# Altium project ESP32_INDUSTRIAL_IO_BASEBOARD.PrjPcb (part 1 of 2)
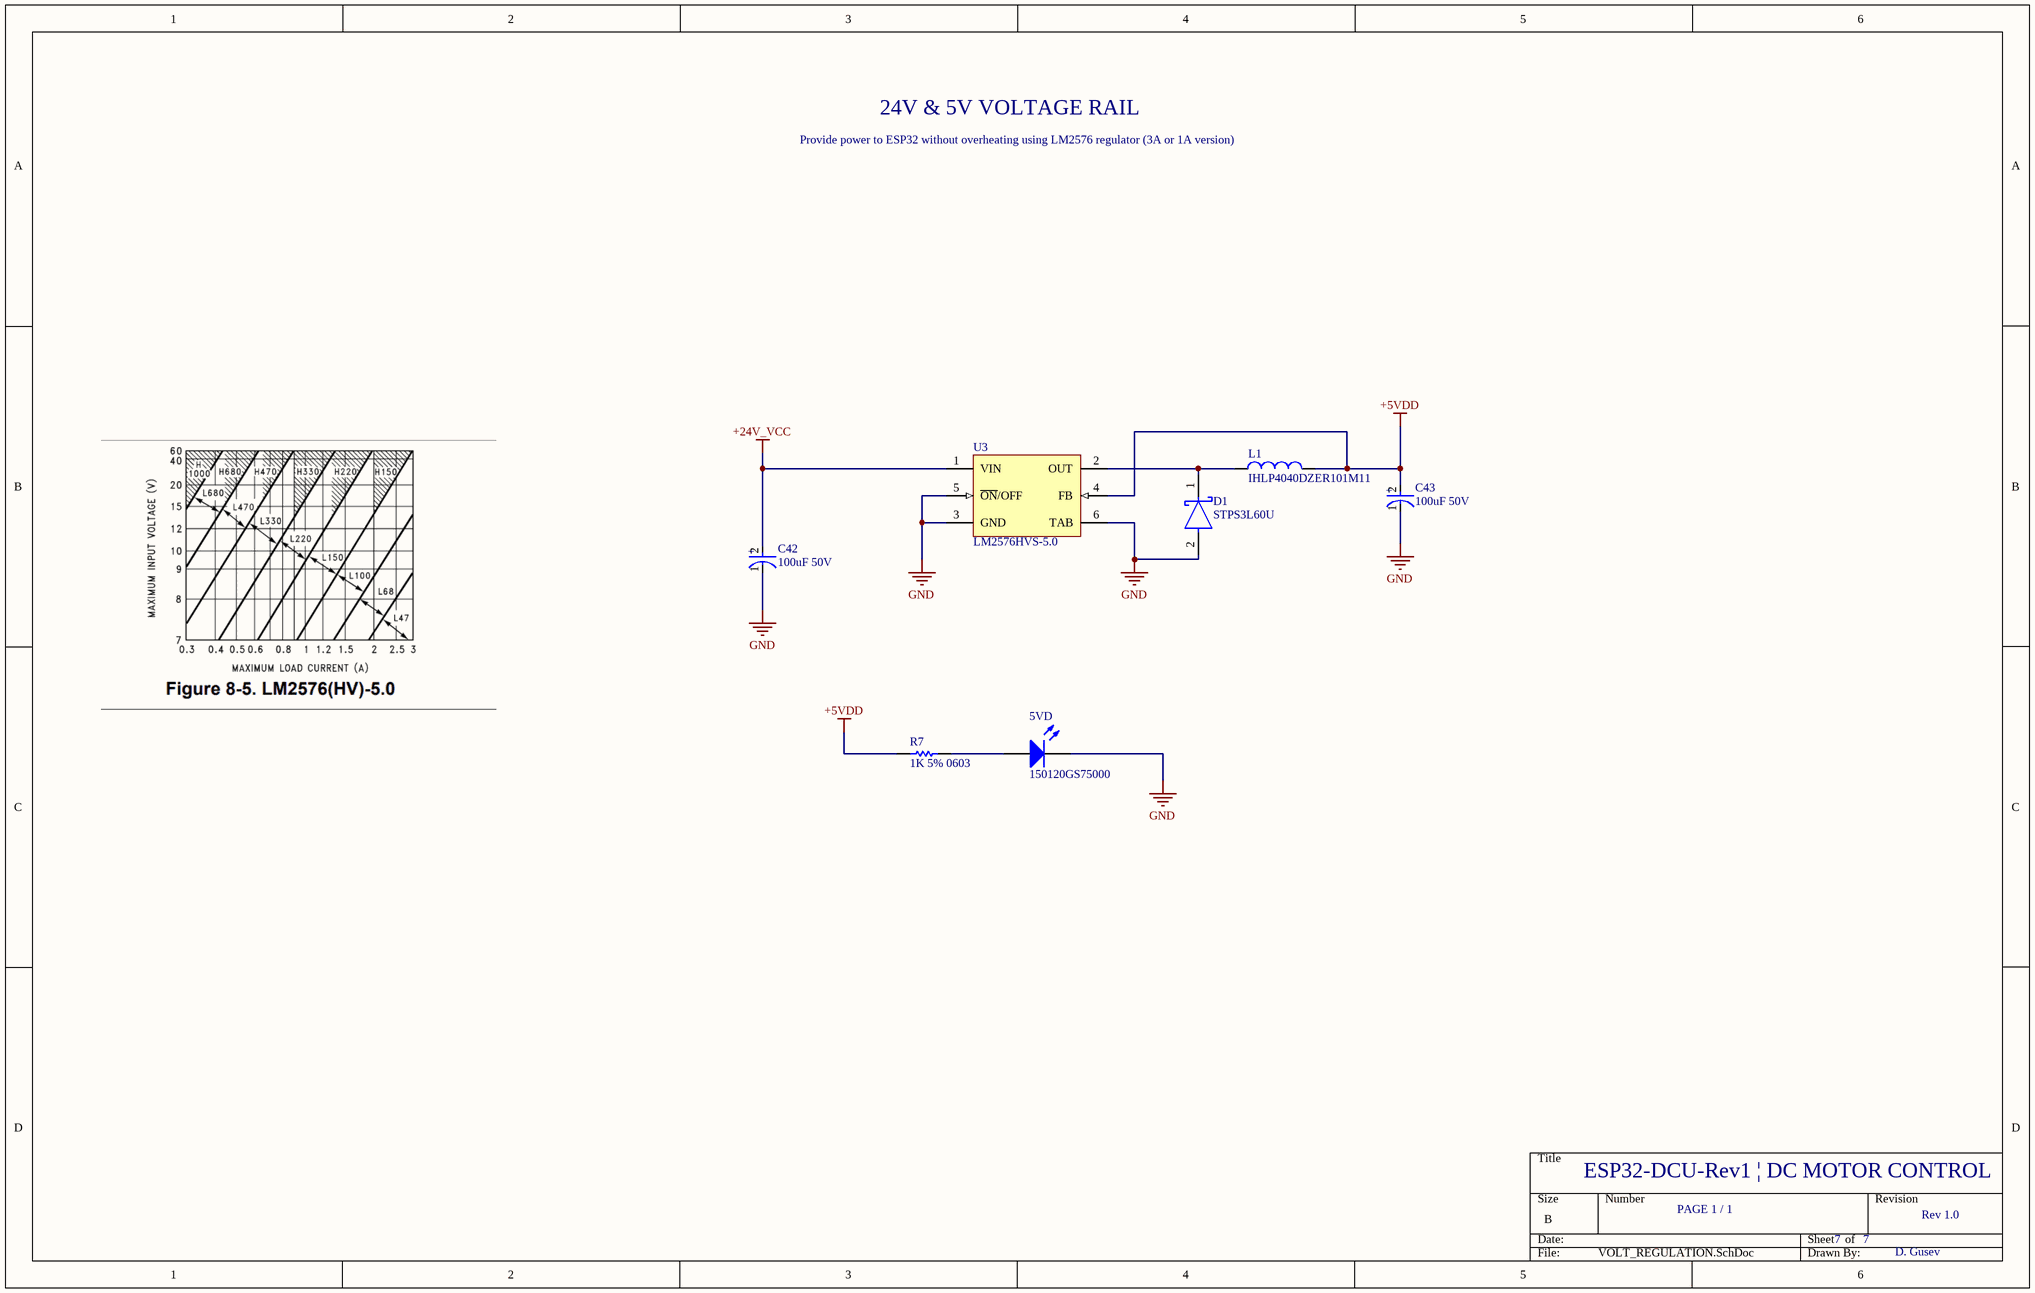
[diagram p0: VOLT_REGULATION.SchDoc]
7 sheets, 130 parts. Net scope: flat (ports and power ports of the same name join across sheets).
Board file: ESP32_INDUSTRIAL_IO_BASEBOARD.PcbDoc
Sheets:
  VOLT_REGULATION.SchDoc
  USB-ESP32.SchDoc
  ESP32.SchDoc
  LAN9252-1.SchDoc
  LAN9252-2.SchDoc
  EtherCAT.SchDoc
  CONN.SchDoc

## Sheet VOLT_REGULATION.SchDoc
size B

### Parts
5VD  150120GS75000  [1206_A]
C42  100uF 50V  [FP-EEE-FK1H101P-MFG]
C43  100uF 50V  [FP-EEE-FK1H101P-MFG]
D1  STPS3L60U  [FP-SMB-MFG]
L1  IHLP4040DZER101M11  [VISH-IHLP4040DZER101M11_V]
R7  1K 5% 0603  [RESC1608X55X25NL10T15]
U3  LM2576HVS-5.0  [KTT0005B_L]

### Nets
+5VDD: C43.2(A) L1.2 R7.1 U3.4(FB)
+24V_VCC: C42.2(A) U3.1(VIN)
GND: 5VD.1(K) C42.1(C) C43.1(C) D1.2(A) U3.3(GND) U3.5(~{ON}/OFF) U3.6(TAB)
Net5VD_2: 5VD.2(A) R7.2
NetD1_1: D1.1(K) L1.1 U3.2(OUT)

### Notes on the sheet
- Provide power to ESP32 without overheating using LM2576 regulator (3A or 1A version)
- 24V & 5V VOLTAGE RAIL
- ESP32-DCU-Rev1 | DC MOTOR CONTROL
- PAGE 1 / 1
- 7
- Rev 1.0
- D. Gusev
- (in symbol CMP-2000-06208-2) +

### Library data of the parts
5VD = CMP-1426-00014-1: SMD mono-color Chip LED, WL-SMCW, Green; Manufacturer: Wuerth Elektronik; PackageReference: 1206_A; PartNumber: 150120GS75000; ComponentLink1Description: Manufacturer URL; ComponentLink2URL: http://katalog.we-online.com/led/datasheet/150120GS75000.pdf; ComponentLink2Description: Datasheet; Color: Green; ComponentLink1URL: http://www.we-online.com
C42 C43 = CMP-2000-06208-2: CAP ALUM 100UF 20% 50V SMD; Manufacturer Part Number: EEE-FK1H101P; Manufacturer: Panasonic Electronic Components; Automotive Grade: Grade 2; Dissipation Factor: 10%; Life: 2000Hours; Ripple Current: 350mA; Material: Aluminum; Esr: 0.34Ω; Leakage Current: 50uA; Tolerance: 20%; Package: 0; ComponentLink2URL: https://industrial.panasonic.com/cdbs/www-data/pdf/RDE0000/ABA0000C1181.pdf; Temperature Range Low: -55°C; Voltage Rating: 50V; ComponentLink2Description: Datasheet; Category: Cap; Digikey Description: CAP ALUM 100UF 20% 50V SMD; Octopart: https://octopart.com/eeefk1h101p-panasonic-4642841; Automotive: Yes; Temperature: -55°C to +105°C; Capacitance: 100uF; Lead Free: Yes; Mouser Description: Cap Aluminum Lytic 100uF 50V 20% (8 X 10.2mm) SMD 350mA 2000h 105C Automotive T/R; Height: 10.5mm; Device Class L3: Aluminum Electrolytic Capacitors; Value: 100uF; Device Class L1: Passive Components; RoHS: TRUE; Device Class L2: Capacitors; Temperature Range High: +105°C
D1 = CMP-12187-000023-1: DIODE SCHOTTKY 60V 3A SMB; Manufacturer: STMicroelectronics; Standoff Height: 0.05mm; Peak Reverse Current: 150uA; Max Junction Temp: +150°C; Max Surge Forward Current: 100A; Octopart: https://octopart.com/stps3l60u-stmicroelectronics-334329; Category: Diode; Height: 2.65mm; RoHS: TRUE; Mouser Description: Schottky diode Configuration: Single Housing type: DO-214AA=SMB Peak conducting-state current: 100 A; Forward Current: 3A; Manufacturer Part Number: STPS3L60U; Temperature: to +150°C; ComponentLink2URL: https://www.st.com/resource/en/datasheet/stps3l60.pdf; Max Repetitive Reverse Voltage: 60V; Device Class L1: Discrete Semiconductors; Automotive: No; Device Class L3: Schottky Diodes; Digikey Description: DIODE SCHOTTKY 60V 3A SMB; Lead Free: Yes; Temperature Range High: +150°C; Package: SMB; ComponentLink2Description: Datasheet; Device Class L2: Diodes
L1 = CMP-2000-06447-1: Low Profile, High Current IHLP(R) Inductor, 100 uH, +/- 20%, 2.5 A, -55 to 125 degC, 2-Pin SMD, RoHS, Tape and Reel; Manufacturer: Vishay; Qualification: AEC-Q200; Test Frequency: 100kHz; Maximum DC Resistance: 270mOhms; Type: LowProfileHighCurrentIHLPInductor; Inductance: 100uH; Unit Weight: 0.070548oz; Shielding: Shielded; Brand: Vishay/Dale; Maximum DC Current: 2.25A; Termination Style: SMD/SMT; Mounting Style: SMD/SMT; Tolerance: 20%; Factory Pack Quantity: 500; Product Category: FixedInductors; Mounting Technology: SurfaceMount; Manufacturer URL: http://www.vishay.com/; Operating Temperature Range: -55Cto+125C; Datasheet Version: 08/2015; Product: PowerInductors; Packaging: Reel; Length: 10.3mm; Package Description: 2-Pin Surface Mount Device, Body 10.3 x 10.3 mm; Height: 4mm; Width: 10.3mm; Series: IHLP-4040DZ-11; RoHS: True; Package Reference: IHLP4040DZER101M11; Tradename: IHLP; Datasheet URL: http://www.vishay.com/docs/34192/lp40dz11.pdf; Package / Case: 4040
R7 = CMP-1659-00009-4: Chip Resistor, 1 KOhm, +/-1%, 0.1 W, -55 to 155 degC, 0603 (1608 Metric), RoHS, Tape and Reel; Manufacturer: Yageo; Voltage Rating: 50 V; ComponentLink2URL: http://www.yageo.com/documents/recent/PYu-RC_Group_51_RoHS_L_04.pdf; Max Operating Temperature: 155 degC; PackageDescription: 2-Pin Surface Mount Device, Body 1.6 x 0.8 mm; Packaging: Tape and Reel; ComponentLink3Description: Package Specification; REACH SVHC: No SVHC; Mount: Surface Mount; ComponentLink2Description: Datasheet; Length: 1.6 mm; PackageReference: 0603; Height: 0.45 mm; DatasheetVersion: Rev. 4, 02/2016; Min Operating Temperature: -55 degC; ComponentLink1Description: Manufacturer URL; Package Quantity: 200; RoHSCompliant: true; ComponentLink3URL: http://www.farnell.com/datasheets/443971.pdf; Pins: 2; Mounting Technology: Surface Mount; ComponentLink1URL: http://www.yageo.com/
U3 = CMP-0069-00141-3: SIMPLE SWITCHER® 3A Step-Down Voltage Regulator, 5-pin TO-263; Manufacturer: Texas Instruments; PackageTopMarking: NSUZXYTTE#*LM2576*HVS-5.0 P+; PowerWise: N; RoHS: N; PackageDescription: TO-263, Molded, .400 x .390 x .180in, 5 Lead, .067in Pitch, Surface Mount; Code_JEDEC: MO-169-AB; CompType: Switcher; ComponentLink1URL: http://www.ti.com/general/docs/lit/getliterature.tsp?genericPartNumber=LM2576HV&fileType=pdf; ComponentLink1Description: Datasheet URL; PinCount: 5; PackageReference: KTT0005B

## Sheet USB-ESP32.SchDoc
size B
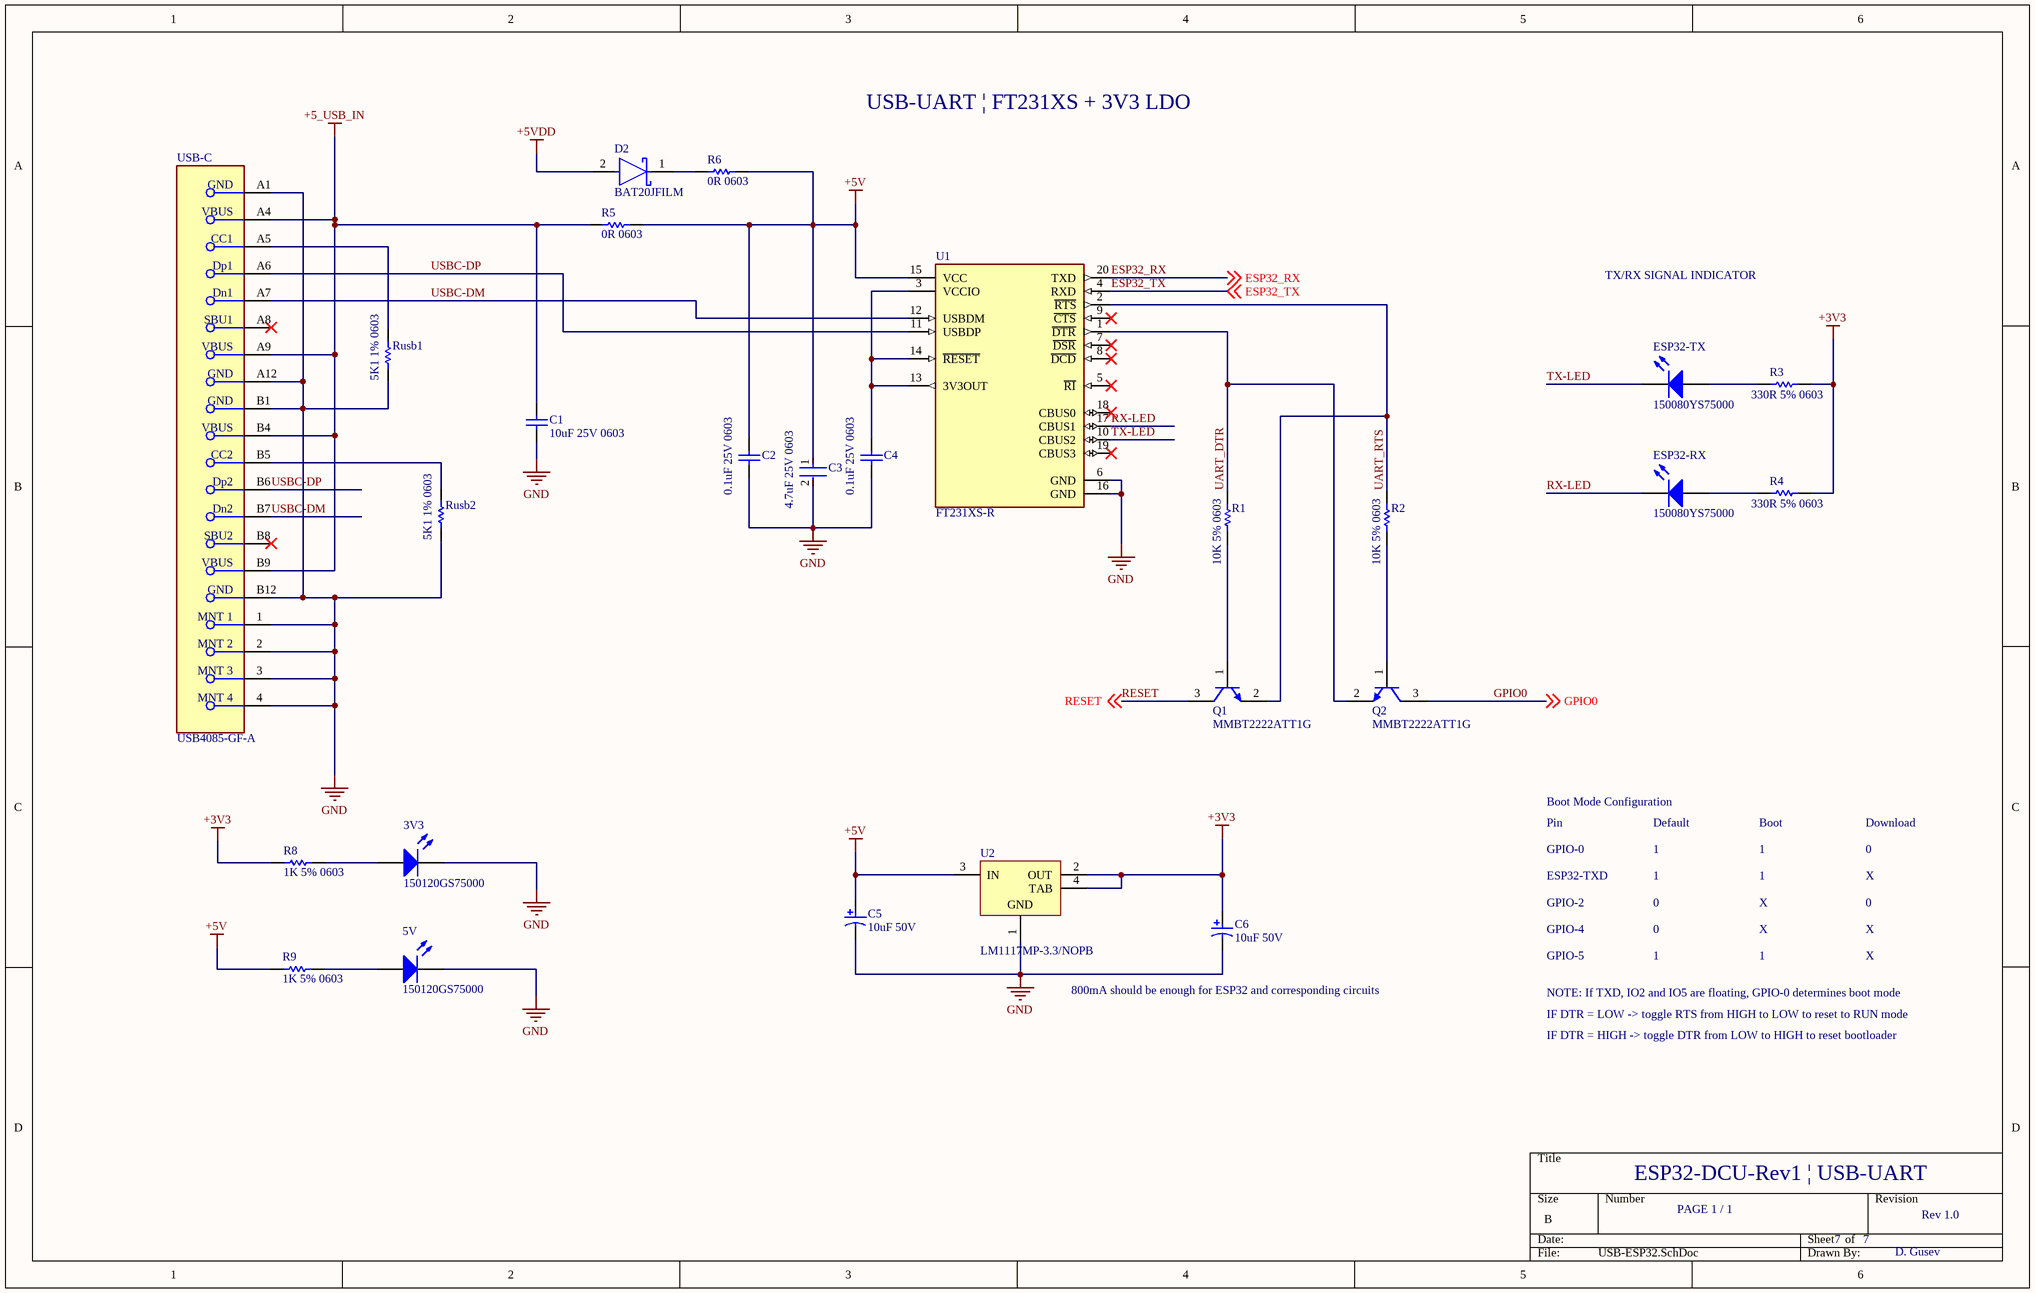
[diagram p1: USB-ESP32.SchDoc]

### Parts
3V3  150120GS75000  [1206_A]
5V  150120GS75000  [1206_A]
C1  10uF 25V 0603  [CAPC1608X100X20VL10T10]
C2  0.1uF 25V 0603  [CAPC1608X90X35LL10T15]
C3  4.7uF 25V 0603  [FP-GRM188-0_15-IPC_C]
C4  0.1uF 25V 0603  [CAPC1608X90X35LL10T15]
C5  10uF 50V  [PNSC-FK-V-D_V]
C6  10uF 50V  [PNSC-FK-V-D_V]
D2  BAT20JFILM  [FP-BAT20JFILM-MFG]
ESP32-RX  150080YS75000  [0805_A]
ESP32-TX  150080YS75000  [0805_A]
Q1  MMBT2222ATT1G  [ONSC-SC-75-3-463-01_V]
Q2  MMBT2222ATT1G  [ONSC-SC-75-3-463-01_V]
R1  10K 5% 0603  [RESC1608X55X25ML10T15]
R2  10K 5% 0603  [RESC1608X55X25ML10T15]
R3  330R 5% 0603  [RESC1608X55X25NL10T15]
R4  330R 5% 0603  [RESC1608X55X25NL10T15]
R5  0R 0603  [RESC1608X55X25ML10T15]
R6  0R 0603  [RESC1608X55X25ML10T15]
R8  1K 5% 0603  [RESC1608X55X25NL10T15]
R9  1K 5% 0603  [RESC1608X55X25NL10T15]
Rusb1  5K1 1% 0603  [RESC1608X55X25ML10T15]
Rusb2  5K1 1% 0603  [RESC1608X55X25ML10T15]
U1  FT231XS-R  [FP-SSOP-20-MFG]
U2  LM1117MP-3.3/NOPB  [DCY0004A_L]
USB-C  USB4085-GF-A  [FP-USB4085-GF-A-MFG]

### Nets
+3V3: C6.1 R3.2 R4.2 R8.1 U2.2(OUT) U2.4(TAB)
+5_USB_IN: C1.2 R5.1 USB-C.A4(VBUS) USB-C.A9(VBUS) USB-C.B4(VBUS) USB-C.B9(VBUS)
+5V: C2.2 C3.1 C5.1 R5.2 R6.2 R9.1 U1.15(VCC) U2.3(IN)
+5VDD: D2.2(A)
GND: 3V3.1(K) 5V.1(K) C1.1 C2.1 C3.2 C4.1 C5.2 C6.2 Rusb1.1 Rusb2.1 U1.6(GND) U1.16(GND) U2.1(GND) USB-C.1(MNT_1) USB-C.2(MNT_2) USB-C.3(MNT_3) USB-C.4(MNT_4) USB-C.A1(GND) USB-C.A12(GND) USB-C.B1(GND) USB-C.B12(GND)
ESP32_RX: U1.20(TXD) ; off-sheet ESP32_RX
ESP32_TX: U1.4(RXD) ; off-sheet ESP32_TX
GPIO0: Q2.3(C) ; off-sheet GPIO0
RESET: Q1.3(C) ; off-sheet RESET
RX-LED: ESP32-RX.1(K) U1.17(CBUS1)
TX-LED: ESP32-TX.1(K) U1.10(CBUS2)
UART_DTR: Q2.2(E) R1.2 U1.1(~{DTR})
UART_RTS: Q1.2(E) R2.2 U1.2(~{RTS})
USBC-DM: U1.12(USBDM) USB-C.A7(Dn1) USB-C.B7(Dn2)
USBC-DP: U1.11(USBDP) USB-C.A6(Dp1) USB-C.B6(Dp2)
Net3V3_2: 3V3.2(A) R8.2
Net5V_2: 5V.2(A) R9.2
NetC4_2: C4.2 U1.3(VCCIO) U1.13(3V3OUT) U1.14(~{RESET})
NetD2_1: D2.1(K) R6.1
NetESP32-RX_2: ESP32-RX.2(A) R4.1
NetESP32-TX_2: ESP32-TX.2(A) R3.1
NetQ1_1: Q1.1(B) R1.1
NetQ2_1: Q2.1(B) R2.1
NetRusb1_2: Rusb1.2 USB-C.A5(CC1)
NetRusb2_2: Rusb2.2 USB-C.B5(CC2)

Not connected (* = marked no-connect by the designer): U1 5(~{RI})* 7(~{DSR})* 8(~{DCD})* 9(~{CTS})* 18(CBUS0)* 19(CBUS3)*; USB-C A8(SBU1)* B8(SBU2)*

### Notes on the sheet
- USB-UART | FT231XS + 3V3 LDO
- TX/RX SIGNAL INDICATOR
- Boot Mode Configuration
- Pin
- Default
- Boot
- Download
- GPIO-0
- ESP32-TXD
- GPIO-2
- 1
- 0
- X
- GPIO-4
- GPIO-5
- 800mA should be enough for ESP32 and corresponding circuits
- NOTE: If TXD, IO2 and IO5 are floating, GPIO-0 determines boot mode
- IF DTR = LOW -> toggle RTS from HIGH to LOW to reset to RUN mode
- IF DTR = HIGH -> toggle DTR from LOW to HIGH to reset bootloader
- ESP32-DCU-Rev1 | USB-UART
- PAGE 1 / 1
- 7
- Rev 1.0
- D. Gusev

### Library data of the parts
3V3 5V = CMP-1426-00014-1: as 5VD on sheet VOLT_REGULATION; PackageReference: 1206_A; PartNumber: 150120GS75000; ComponentLink1Description: Manufacturer URL; ComponentLink2URL: http://katalog.we-online.com/led/datasheet/150120GS75000.pdf; ComponentLink2Description: Datasheet; Color: Green; ComponentLink1URL: http://www.we-online.com
C1 = CMP-2000-05442-1: Chip Capacitor, 10 uF, +/- 20%, 25 V, -55 to 85 degC, 0603 (1608 Metric), RoHS, Tape and Reel; Manufacturer: TDK; PCN Part Number: MLCCPartNumberChange30/Nov/2012; Other Names: 445-9015-1; Capacitance: 10µF; Design Resources: 20WNon-IsolatedBuckLEDDriverUsingPLLNK460KG; Kits: 445-9014-KIT-ND-KITMLCC100PF-22UF060310-50V; Product Training Modules: SEAT,CCV,andTVCLDesignToolsGuidetoReplacinganElectrolyticCapacitorwithanMLCC; Online Catalog: CSeries,GeneralPurpose; Temperature Coefficient: X5R; Package Description: 2-Pin Surface Mount Device, Body 1.6 x 0.8 mm; Lead Style: -; Datasheet URL: http://download.siliconexpert.com/pdfs/2016/2/22/9/40/35/949/tdk_/manual/8010476609961980104703407078c1608x5r1e106m080ac.pdf.pdf; Category: Capacitors; Package / Case: 0603(1608Metric); Packaging: CutTape(CT); Series: C; Features: -; Family: CeramicCapacitors; Standard Package: 1; Tolerance: ±20%; Operating Temperature: -55degC~85degC; Mounting Type: SurfaceMount,MLCC; Ratings: -; Size / Dimension: 0.063"Lx0.031"W(1.60mmx0.80mm); Applications: GeneralPurpose; Package Reference: 1608; RoHS Information: RoHSCertificate-MLCC; Manufacturer URL: http://www.tdk.com/; Datasheet Version: Feb-16; Voltage - Rated: 25V; Height - Seated (Max): -; Thickness (Max): 0.039"(1.00mm); Lead Spacing: -
C2 C4 = CMP-2006-02868-1: Part Number: GRM188R71E104KA01D; Manufacturer: Murata
C3 = CMP-2006-02523-2: Chip Multilayer Ceramic Capacitors for General Purpose, 0603, 4.7uF, X5R, 15%, 10%, 25V; Case Code (Metric): 1608; Max Operating Temperature: 85°C; REACH SVHC: No SVHC; Voltage Rating: 25V; Dielectric: X5R; Packaging: Cut Tape; Width: 0.031inch; Min Operating Temperature: -55°C; Lead Free: Lead Free; Capacitance: 4.7uF; Height: 0.8mm; Case Code (Imperial): 0603; Length: 1.6mm; Voltage Rating (DC): 25V; Case/Package: 0603; Voltage: 25V; Tolerance: 10%; Thickness: 0.031inch; Mount: Surface Mount; Material: Ceramic; Package Quantity: 4000; Depth: 0.8mm
C5 C6 = CMP-2000-06207-1: Aluminum Electrolytic Capacitor, 10 uF, +/- 20%, 50 V, 2-Pin SMD (Size Code D), -55 to 105 degC, RoHS, Tape and Reel; Manufacturer: Panasonic; Lifetime@Temperature: 2000Hrs@105°C; Type: Can; Ripple Current: 165mA; Impedance: 0.88O; Capacitance: 10µF; Manufacturer URL: http://www.panasonic.com/; Mounting Technology: SurfaceMount; Rated Voltage: 50V; Datasheet URL: http://industrial.panasonic.com/cdbs/www-data/pdf/RDE0000/ABA0000C1181.pdf; Package Reference: FK-V-D; Series: FK; Operating Temp Range: -55to+105°C; Operating Temp-Max: 105°C; Datasheet Version: 03/2016; Package URL: http://industrial.panasonic.com/cdbs/www-data/pdf/RDE0000/DME0000COL48.pdf; Case Size/Dimension: Ø6.3x5.8mm; Package Description: 2-Pin Electrolytic Aluminum Capacitor, Body 6.6 x 6.6 mm
D2 = CMP-12187-000030-1: DIODE SCHOTTKY 23V 1A SOD323; Polarity: Standard; Element Configuration: Single; Capacitance: 30pF; Forward Voltage: 620mV; Max Surge Current: 5A; Peak Reverse Current: 12uA; Packaging: Tape and Reel; Weight: 0.01lb; Output Current: 1A; Lead Free: Lead Free; Forward Current: 1A; Mount: Surface Mount; Max Reverse Voltage (DC): 23V; Average Rectified Current: 1A; Max Operating Temperature: 150°C; Max Forward Surge Current (Ifsm): 5A; REACH SVHC: No SVHC; Current Rating: 1A; Length: 1.8mm; Radiation Hardening: No; Max Reverse Leakage Current: 12uA; Voltage Rating (DC): 23V; Height: 1.03mm; Peak Non-Repetitive Surge Current: 5A; Max Repetitive Reverse Voltage (Vrrm): 23V; Min Operating Temperature: -65°C; Number of Pins: 2; Width: 1.35mm; Package Quantity: 1
ESP32-RX ESP32-TX = CMP-1426-00012-1: SMD mono-color Chip LED, WL-SMCW, Yellow; Manufacturer: Wuerth Elektronik; Color: Yellow; ComponentLink1URL: http://www.we-online.com; PackageReference: 0805_A; ComponentLink2URL: http://katalog.we-online.com/led/datasheet/150080YS75000.pdf; ComponentLink1Description: Manufacturer URL; ComponentLink2Description: Datasheet; PartNumber: 150080YS75000
Q1 Q2 = CMP-1048-00417-1: General Purpose Transistor, NPN Silicon, 3-Pin SC-75, Pb-Free, Tape and Reel; Manufacturer: On Semiconductor; IC Continuous (A): 0.6; fT Min (MHz): 300; DatasheetVersion: Rev. 5; PackageVersion: Rev. F, 07/2005; ComponentLink1Description: Manufacturer URL; RoHS: TRUE; Packing: Tape and Reel; ComponentLink3URL: http://www.onsemi.com/pub_link/Collateral/463-01.PDF; ComponentLink1URL: http://www.onsemi.com/; ComponentLink3Description: Package Specification; ComponentLink2URL: http://www.onsemi.cn/pub_link/Collateral/MMBT2222ATT1-D.PDF; Mounting Technology: Surface Mount; PartNumber: MMBT2222ATT1G; ComponentLink2Description: Datasheet; Polarity: NPN; PackageReference: SC-75-3-463-01; PackageDescription: 3-Pin Small Outline Transistor, Body 1.6 x 0.8 mm, Pitch 0.5 mm
R1 R2 = CMP-2100-03664-1: Chip Resistor, 10 KOhm, +/- 1%, 01 W, -55 to 155 degC, 0603 (1608 Metric), RoHS, Tape and Reel; Manufacturer: Yageo; Temperature Coefficient: 100ppm/degreesC; Resistance: 10KOhm; Voltage Rating: 75V; Power Rating: 100mW; Voltage Rating (DC): 50V; Composition: ThickFilm; RoHSCompliant: true; Height: 0.45mm; Lead Free: LeadFree; Case Code (Metric): 1608; Case/Package: 0603; Datasheet Version: Rev. 5, 10/2016; Package Reference: 0603; Depth: 0.8mm; Package Description: 2-Pin Surface Mount Device, Body 1.6 x 0.8 mm; Case Code (Imperial): 0603; Packaging: TapeandReel; Termination: SMD/SMT; Lead Pitch: 0.3mm; Width: 0.8mm; Number of Pins: 2; Length: 1.6mm; REACH SVHC: NoSVHC; Military Standard: Not; Max Operating Temperature: 155degC; Min Operating Temperature: -55degC; Manufacturer URL: http://www.yageo.com/; Datasheet URL: http://www.yageo.com/NewPortal/yageodocoutput?fileName=/pdf/R-Chip/PYu-RC_Group_51_RoHS_L_5.pdf; Weight: 7.1E-05oz; Tolerance: 1%
R3 R4 = CMP-1659-00020-2: Chip Resistor, 330 Ohm, +/- 1%, 0.1 W, -55 to 155 degC, 0603 (1608 Metric), RoHS, Tape and Reel; Tolerance: 10%; ESR: 800 mohm; Voltage Rating (DC): 16 V; Capacitance: 47 uF; Length: 7.3 mm; ComponentLink1URL: http://www.yageo.com/; Packaging: Tape and Reel; Pins: 2; ComponentLink1Description: Manufacturer URL; Case Code (Imperial): 2917; REACH SVHC: No SVHC; Width: 4.3 mm; ComponentLink2Description: Datasheet; Voltage Rating: 16 V; RoHSCompliant: True; Max Operating Temperature: 125degC; ComponentLink2URL: http://www.yageo.com/documents/recent/PYu-RC_Group_51_RoHS_L_04.pdf; Min Operating Temperature: -55degC; Case/Package: 2917; Radiation Hardening: No; DatasheetVersion: Rev. 4, 02/2016; Mount: Surface Mount; PackageReference: 0603; Package Quantity: 500; Case Code (Metric): 7343; PackageDescription: 2-Pin Surface Mount Device, Body 1.6 x 0.8 mm; Height: 3.1 mm
R5 R6 = CMP-2100-03667-1: Chip Resistor, 0 Ohm, +/- 5%, 0.1 W, -55 to 155 degC, 0603 (1608 Metric), RoHS, Tape and Reel; Manufacturer: Yageo; Temperature Coefficient: 200ppm/degreesC; Voltage Rating: 50V; Power Rating: 100mW; Resistance: 0mOhm; Width: 0.8mm; Max Operating Temperature: 155degC; Tolerance: 5%; Package Reference: 0603; Height: 0.45mm; Depth: 0.8mm; Package Description: 2-Pin Surface Mount Device, Body 1.6 x 0.8 mm; Termination: SMD/SMT; Package Quantity: 5000; Case/Package: 0603; Case Code (Imperial): 0603; Radiation Hardening: No; Number of Pins: 2; Length: 1.6mm; Lead Free: LeadFree; Voltage Rating (DC): 50V; Military Standard: Not; Datasheet URL: http://www.yageo.com/NewPortal/yageodocoutput?fileName=/pdf/R-Chip/PYu-RC_Group_51_RoHS_L_5.pdf; Manufacturer URL: http://www.yageo.com/; Packaging: TapeandReel; Case Code (Metric): 1608; Min Operating Temperature: -55degC; Composition: ThickFilm; RoHSCompliant: true; Contact Plating: Tin; Datasheet Version: Rev. 5, 10/2016; REACH SVHC: NoSVHC
R8 R9 = CMP-1659-00009-4: as R7 on sheet VOLT_REGULATION; ComponentLink2URL: http://www.yageo.com/documents/recent/PYu-RC_Group_51_RoHS_L_04.pdf; Max Operating Temperature: 155 degC; PackageDescription: 2-Pin Surface Mount Device, Body 1.6 x 0.8 mm; Packaging: Tape and Reel; ComponentLink3Description: Package Specification; REACH SVHC: No SVHC; Mount: Surface Mount; ComponentLink2Description: Datasheet; Length: 1.6 mm; PackageReference: 0603; Height: 0.45 mm; DatasheetVersion: Rev. 4, 02/2016; Min Operating Temperature: -55 degC; ComponentLink1Description: Manufacturer URL; Package Quantity: 200; RoHSCompliant: true; ComponentLink3URL: http://www.farnell.com/datasheets/443971.pdf; Pins: 2; Mounting Technology: Surface Mount; ComponentLink1URL: http://www.yageo.com/
Rusb1 Rusb2 = CMP-2000-04091-1: Manufacturer: Yageo; Part Number: RC0603FR-075K1L
U1 = CMP-0248-00024-3: IC USB SERIAL FULL UART 20SSOP; Operating Supply Voltage: 5V; Operating Supply Current: 8mA; Number of Channels: 1; Min Supply Voltage: 2.97V; Max Supply Voltage: 5.5V; Data Rate: 12Mbps; Height: 0.059inch; Packaging: Tape and Reel; Mount: Surface Mount; Package Quantity: 2000; Radiation Hardening: No; Case/Package: SSOP; Min Operating Temperature: -40°C; Width: 0.157inch; Number of Pins: 20; Weight: 0.016oz; Interface: UART; Max Operating Temperature: 85°C; Length: 8.74mm
U2 = CMP-0062-01638-4: 800mA Low-Dropout Linear Regulator, 4-pin SOT-223, Pb-Free; Manufacturer: Texas Instruments; CompType: LDO IC; PackageTopMarking: XYTT*N05A; High-Reliability: Y; PowerWise: N; ComponentLink1URL: http://www.ti.com/general/docs/lit/getliterature.tsp?genericPartNumber=LM1117-N&fileType=pdf; PinCount: 4; PackageDescription: Molded SOT-223, 6.50 x 3.56 x 1.6mm Body, 4 Lead, 2.3mm Pitch; Code_IPC: SOT223-4; PartNumber: LM1117MP-3.3/NOPB; Code_JEDEC: TO-261-AA; RoHS: Y; PackageReference: DCY0004A; ComponentLink1Description: Datasheet URL
USB-C = CMP-196119-000001-1: CONN RCPT USB2.0 TYPEC 16POS; Manufacturer: Global Connector Technology; Voltage Rating: 20V; Conn Orientation: Right Angle; Shielding: true; Current Rating: 4.25A; Number Of Contacts: 16; Pitch: 0.85mm; Is Female: yes; ComponentLink2URL: https://gct.co/files/drawings/usb4085.pdf; Category: Conn; Automotive: No; ComponentLink2Description: Datasheet; Height: 3.66mm; Manufacturer Part Number: USB4085-GF-A; Package: 0; Usb Standard: USB 2.0; Octopart: https://octopart.com/usb4085-gf-a-global+connector+technology-94773699; Device Class L3: unset; Digikey Description: CONN RCPT USB2.0 TYPEC 16POS; Temperature Range Low: -40°C; Temperature: -40°C to +85°C; Lead Free: Yes; Contact Material: Gold,Nickel; Device Class L1: Connectors; Temperature Range High: +85°C; Device Class L2: USB Connectors; RoHS: TRUE

## Sheet ESP32.SchDoc
size B
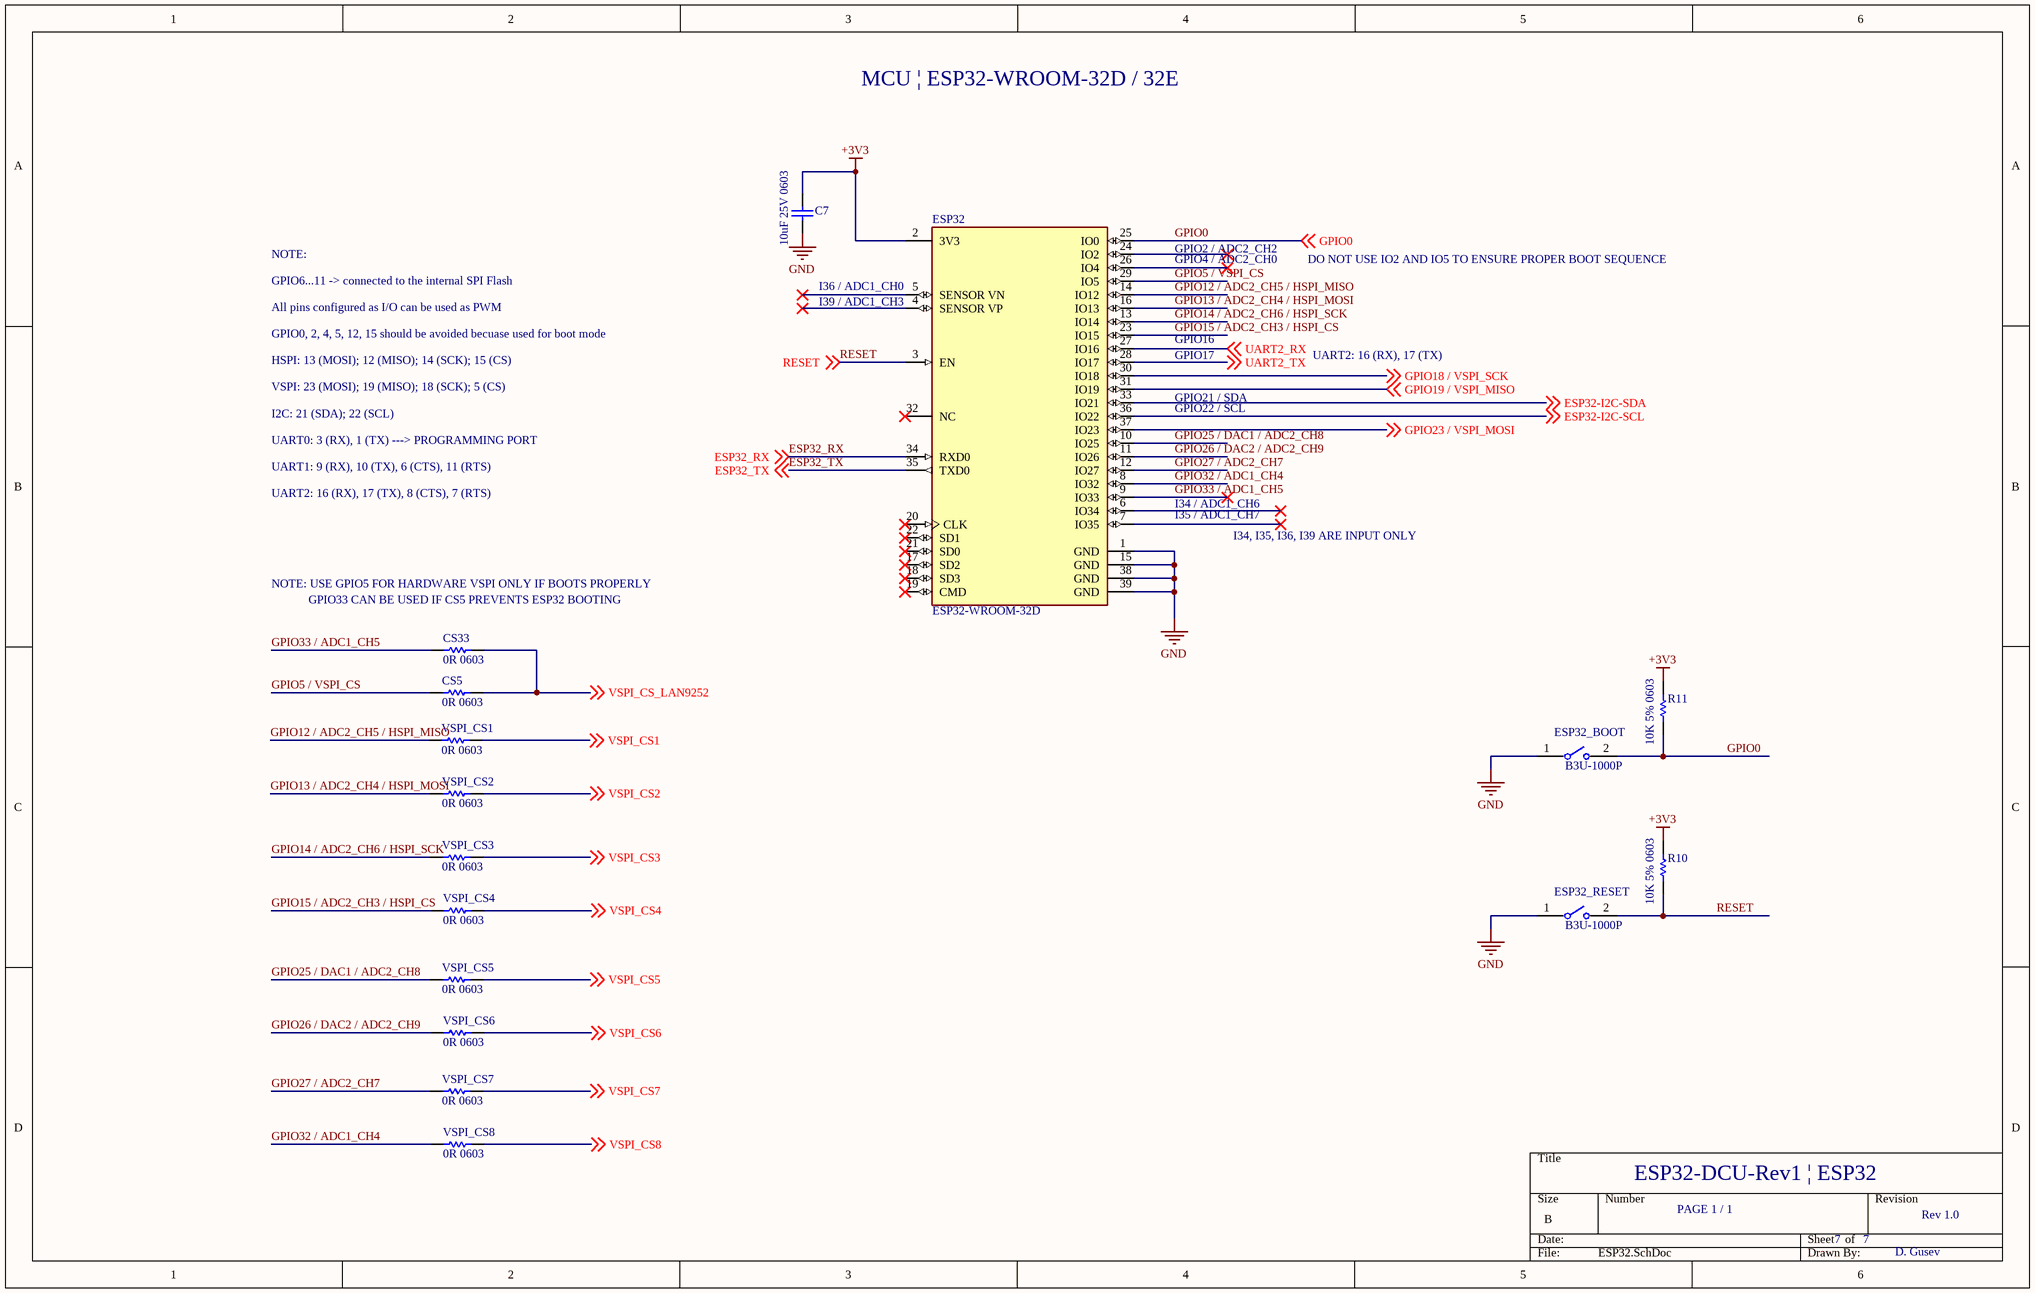
[diagram p2: ESP32.SchDoc]

### Parts
C7  10uF 25V 0603  [CAPC1608X100X20VL10T10]
CS5  0R 0603  [RESC1608X55X25ML10T15]
CS33  0R 0603  [RESC1608X55X25ML10T15]
ESP32  ESP32-WROOM-32D  [FP-ESP32-WROOM-32D-MFG]
ESP32_BOOT  B3U-1000P  [FP-B3U-1000P-MFG]
ESP32_RESET  B3U-1000P  [FP-B3U-1000P-MFG]
R10  10K 5% 0603  [RESC1608X55X25ML10T15]
R11  10K 5% 0603  [RESC1608X55X25ML10T15]
VSPI_CS1  0R 0603  [RESC1608X55X25ML10T15]
VSPI_CS2  0R 0603  [RESC1608X55X25ML10T15]
VSPI_CS3  0R 0603  [RESC1608X55X25ML10T15]
VSPI_CS4  0R 0603  [RESC1608X55X25ML10T15]
VSPI_CS5  0R 0603  [RESC1608X55X25ML10T15]
VSPI_CS6  0R 0603  [RESC1608X55X25ML10T15]
VSPI_CS7  0R 0603  [RESC1608X55X25ML10T15]
VSPI_CS8  0R 0603  [RESC1608X55X25ML10T15]

### Nets
+3V3: C7.2 ESP32.2(3V3) R10.2 R11.2
GND: C7.1 ESP32.1(GND) ESP32.15(GND) ESP32.38(GND) ESP32.39(GND) ESP32_BOOT.1 ESP32_RESET.1
ESP32-I2C-SCL: ESP32.36(IO22) ; off-sheet ESP32-I2C-SCL
ESP32-I2C-SDA: ESP32.33(IO21) ; off-sheet ESP32-I2C-SDA
ESP32_RX: ESP32.34(RXD0) ; off-sheet ESP32_RX
ESP32_TX: ESP32.35(TXD0) ; off-sheet ESP32_TX
GPIO0: ESP32.25(IO0) ESP32_BOOT.2 R11.1 ; off-sheet GPIO0
GPIO5 / VSPI_CS: CS5.1 ESP32.29(IO5)
GPIO12 / ADC2_CH5 / HSPI_MISO: ESP32.14(IO12) VSPI_CS1.1
GPIO13 / ADC2_CH4 / HSPI_MOSI: ESP32.16(IO13) VSPI_CS2.1
GPIO14 / ADC2_CH6 / HSPI_SCK: ESP32.13(IO14) VSPI_CS3.1
GPIO15 / ADC2_CH3 / HSPI_CS: ESP32.23(IO15) VSPI_CS4.1
GPIO18 / VSPI_SCK: ESP32.30(IO18) ; off-sheet GPIO18 / VSPI_SCK
GPIO19 / VSPI_MISO: ESP32.31(IO19) ; off-sheet GPIO19 / VSPI_MISO
GPIO23 / VSPI_MOSI: ESP32.37(IO23) ; off-sheet GPIO23 / VSPI_MOSI
GPIO25 / DAC1 / ADC2_CH8: ESP32.10(IO25) VSPI_CS5.1
GPIO26 / DAC2 / ADC2_CH9: ESP32.11(IO26) VSPI_CS6.1
GPIO27 / ADC2_CH7: ESP32.12(IO27) VSPI_CS7.1
GPIO32 / ADC1_CH4: ESP32.8(IO32) VSPI_CS8.1
GPIO33 / ADC1_CH5: CS33.1 ESP32.9(IO33)
RESET: ESP32.3(EN) ESP32_RESET.2 R10.1 ; off-sheet RESET
UART2_RX: ESP32.27(IO16) ; off-sheet UART2_RX
UART2_TX: ESP32.28(IO17) ; off-sheet UART2_TX
VSPI_CS1: VSPI_CS1.2 ; off-sheet VSPI_CS1
VSPI_CS2: VSPI_CS2.2 ; off-sheet VSPI_CS2
VSPI_CS3: VSPI_CS3.2 ; off-sheet VSPI_CS3
VSPI_CS4: VSPI_CS4.2 ; off-sheet VSPI_CS4
VSPI_CS5: VSPI_CS5.2 ; off-sheet VSPI_CS5
VSPI_CS6: VSPI_CS6.2 ; off-sheet VSPI_CS6
VSPI_CS7: VSPI_CS7.2 ; off-sheet VSPI_CS7
VSPI_CS8: VSPI_CS8.2 ; off-sheet VSPI_CS8
VSPI_CS_LAN9252: CS5.2 CS33.2 ; off-sheet VSPI_CS_LAN9252

Not connected (* = marked no-connect by the designer): ESP32 4(SENSOR_VP)* 5(SENSOR_VN)* 6(IO34)* 7(IO35)* 17(SD2)* 18(SD3)* 19(CMD)* 20(CLK)* 21(SD0)* 22(SD1)* 24(IO2)* 26(IO4)* 32(NC)*

### Notes on the sheet
- MCU | ESP32-WROOM-32D / 32E
- NOTE:
- GPIO6...11 -> connected to the internal SPI Flash
- (near ESP32) I36 / ADC1_CH0
- GPIO2 / ADC2_CH2
- GPIO4 / ADC2_CH0
- DO NOT USE IO2 AND IO5 TO ENSURE PROPER BOOT SEQUENCE
- All pins configured as I/O can be used as PWM
- GPIO0, 2, 4, 5, 12, 15 should be avoided becuase used for boot mode
- HSPI: 13 (MOSI); 12 (MISO); 14 (SCK); 15 (CS)
- (near ESP32) I39 / ADC1_CH3
- GPIO16
- GPIO17
- UART2: 16 (RX), 17 (TX)
- VSPI: 23 (MOSI); 19 (MISO); 18 (SCK); 5 (CS)
- I2C: 21 (SDA); 22 (SCL)
- GPIO21 / SDA
- GPIO22 / SCL
- UART0: 3 (RX), 1 (TX) ---> PROGRAMMING PORT
- UART1: 9 (RX), 10 (TX), 6 (CTS), 11 (RTS)
- UART2: 16 (RX), 17 (TX), 8 (CTS), 7 (RTS)
- I34 / ADC1_CH6
- I35 / ADC1_CH7
- I34, I35, I36, I39 ARE INPUT ONLY
- NOTE: USE GPIO5 FOR HARDWARE VSPI ONLY IF BOOTS PROPERLY
- (near CS33) GPIO33 CAN BE USED IF CS5 PREVENTS ESP32 BOOTING
- ESP32-DCU-Rev1 | ESP32
- PAGE 1 / 1
- 7
- Rev 1.0
- D. Gusev

### Library data of the parts
C7 = CMP-2000-05442-1: as C1 on sheet USB-ESP32; Package Description: 2-Pin Surface Mount Device, Body 1.6 x 0.8 mm; Lead Style: -; Datasheet URL: http://download.siliconexpert.com/pdfs/2016/2/22/9/40/35/949/tdk_/manual/8010476609961980104703407078c1608x5r1e106m080ac.pdf.pdf; Category: Capacitors; Package / Case: 0603(1608Metric); Packaging: CutTape(CT); Series: C; Features: -; Family: CeramicCapacitors; Standard Package: 1; Tolerance: ±20%; Operating Temperature: -55degC~85degC; Mounting Type: SurfaceMount,MLCC; Ratings: -; Size / Dimension: 0.063"Lx0.031"W(1.60mmx0.80mm); Applications: GeneralPurpose; Package Reference: 1608; RoHS Information: RoHSCertificate-MLCC; Manufacturer URL: http://www.tdk.com/; Datasheet Version: Feb-16; Voltage - Rated: 25V; Height - Seated (Max): -; Thickness (Max): 0.039"(1.00mm); Lead Spacing: -
CS5 CS33 VSPI_CS1-VSPI_CS8 = CMP-2100-03667-1: as R5 on sheet USB-ESP32; Width: 0.8mm; Max Operating Temperature: 155degC; Tolerance: 5%; Package Reference: 0603; Height: 0.45mm; Depth: 0.8mm; Package Description: 2-Pin Surface Mount Device, Body 1.6 x 0.8 mm; Termination: SMD/SMT; Package Quantity: 5000; Case/Package: 0603; Case Code (Imperial): 0603; Radiation Hardening: No; Number of Pins: 2; Length: 1.6mm; Lead Free: LeadFree; Voltage Rating (DC): 50V; Military Standard: Not; Datasheet URL: http://www.yageo.com/NewPortal/yageodocoutput?fileName=/pdf/R-Chip/PYu-RC_Group_51_RoHS_L_5.pdf; Manufacturer URL: http://www.yageo.com/; Packaging: TapeandReel; Case Code (Metric): 1608; Min Operating Temperature: -55degC; Composition: ThickFilm; RoHSCompliant: true; Contact Plating: Tin; Datasheet Version: Rev. 5, 10/2016; REACH SVHC: NoSVHC
ESP32 = CMP-194065-000003-1: WIFI MODULE 32MBITS SPI FLASH; Manufacturer: Espressif Systems; Max Supply Voltage: 3.6V; Nominal Supply Current: 500mA; Max Frequency: 2484MHz; Number Of Adc Channels: 16; Number Of Gpio: 32; Interface: I2C,SPI,UART,Ethernet,I2S,Other; Data Rate: 150Mbits/s; Min Supply Voltage: 3V; Bandwidth: 72MHz; Sensitivity: -98dBm; Octopart: https://octopart.com/esp32-wroom-32d-espressif+systems-91040050; Package: ESP32-WROOM-32D; ComponentLink2URL: https://www.espressif.com/sites/default/files/documentation/esp32-wroom-32d_esp32-wroom-32u_datasheet_en.pdf; Lead Free: Yes; Category: UNK; Mouser Description: Wi-Fi/BT BLE Module ESP32-D0WD, SPI Flash, UART, P; Device Class L1: Integrated Circuits (ICs); RoHS: TRUE; Temperature Range Low: -40°C; ComponentLink2Description: Datasheet; Digikey Description: WIFI MODULE 32MBITS SPI FLASH; Height: 3.2mm; Temperature: -40°C to +85°C; Manufacturer Part Number: ESP32-WROOM-32D; Device Class L3: Transceivers; Device Class L2: RF Semiconductors and Devices; Temperature Range High: +85°C; Automotive: No
ESP32_BOOT ESP32_RESET = CMP-2100-03586-2: SWITCH TACTILE SPST-NO 0.05A 12V; Contact Resistance: 100mR; Operating Force: 1.5N; Max Current Rating: 50mA; Switch Travel: 0.15mm; Actuator Type: Standard; Mechanical Life: 200000Cycles; Ratings: Dust Proof; Illumination Type: Non-Illuminated; Throw Configuration: SPST; Actuator Length: 0.4mm; Switch Function: Off-Mom; Height: 1.2mm; Width: 3mm; Weight: 0.000776oz; Contact Material: Silver; Max Voltage Rating (DC): 12V; Insulation Resistance: 100MR; Lead Free: Lead Free; Current Rating: 50mA; Termination: SMD/SMT; Length: 4mm; Voltage Rating (DC): 12V; Contact Current Rating: 50mA; Orientation: Straight; Depth: 2.5mm; Max Operating Temperature: 70°C; Packaging: Tape and Reel; Min Operating Temperature: -25°C; Package Quantity: 1; Mount: Surface Mount; Electrical Life: 200000Cycles
R10 R11 = CMP-2100-03664-1: as R1 on sheet USB-ESP32; Composition: ThickFilm; RoHSCompliant: true; Height: 0.45mm; Lead Free: LeadFree; Case Code (Metric): 1608; Case/Package: 0603; Datasheet Version: Rev. 5, 10/2016; Package Reference: 0603; Depth: 0.8mm; Package Description: 2-Pin Surface Mount Device, Body 1.6 x 0.8 mm; Case Code (Imperial): 0603; Packaging: TapeandReel; Termination: SMD/SMT; Lead Pitch: 0.3mm; Width: 0.8mm; Number of Pins: 2; Length: 1.6mm; REACH SVHC: NoSVHC; Military Standard: Not; Max Operating Temperature: 155degC; Min Operating Temperature: -55degC; Manufacturer URL: http://www.yageo.com/; Datasheet URL: http://www.yageo.com/NewPortal/yageodocoutput?fileName=/pdf/R-Chip/PYu-RC_Group_51_RoHS_L_5.pdf; Weight: 7.1E-05oz; Tolerance: 1%

## Sheet LAN9252-1.SchDoc
size B
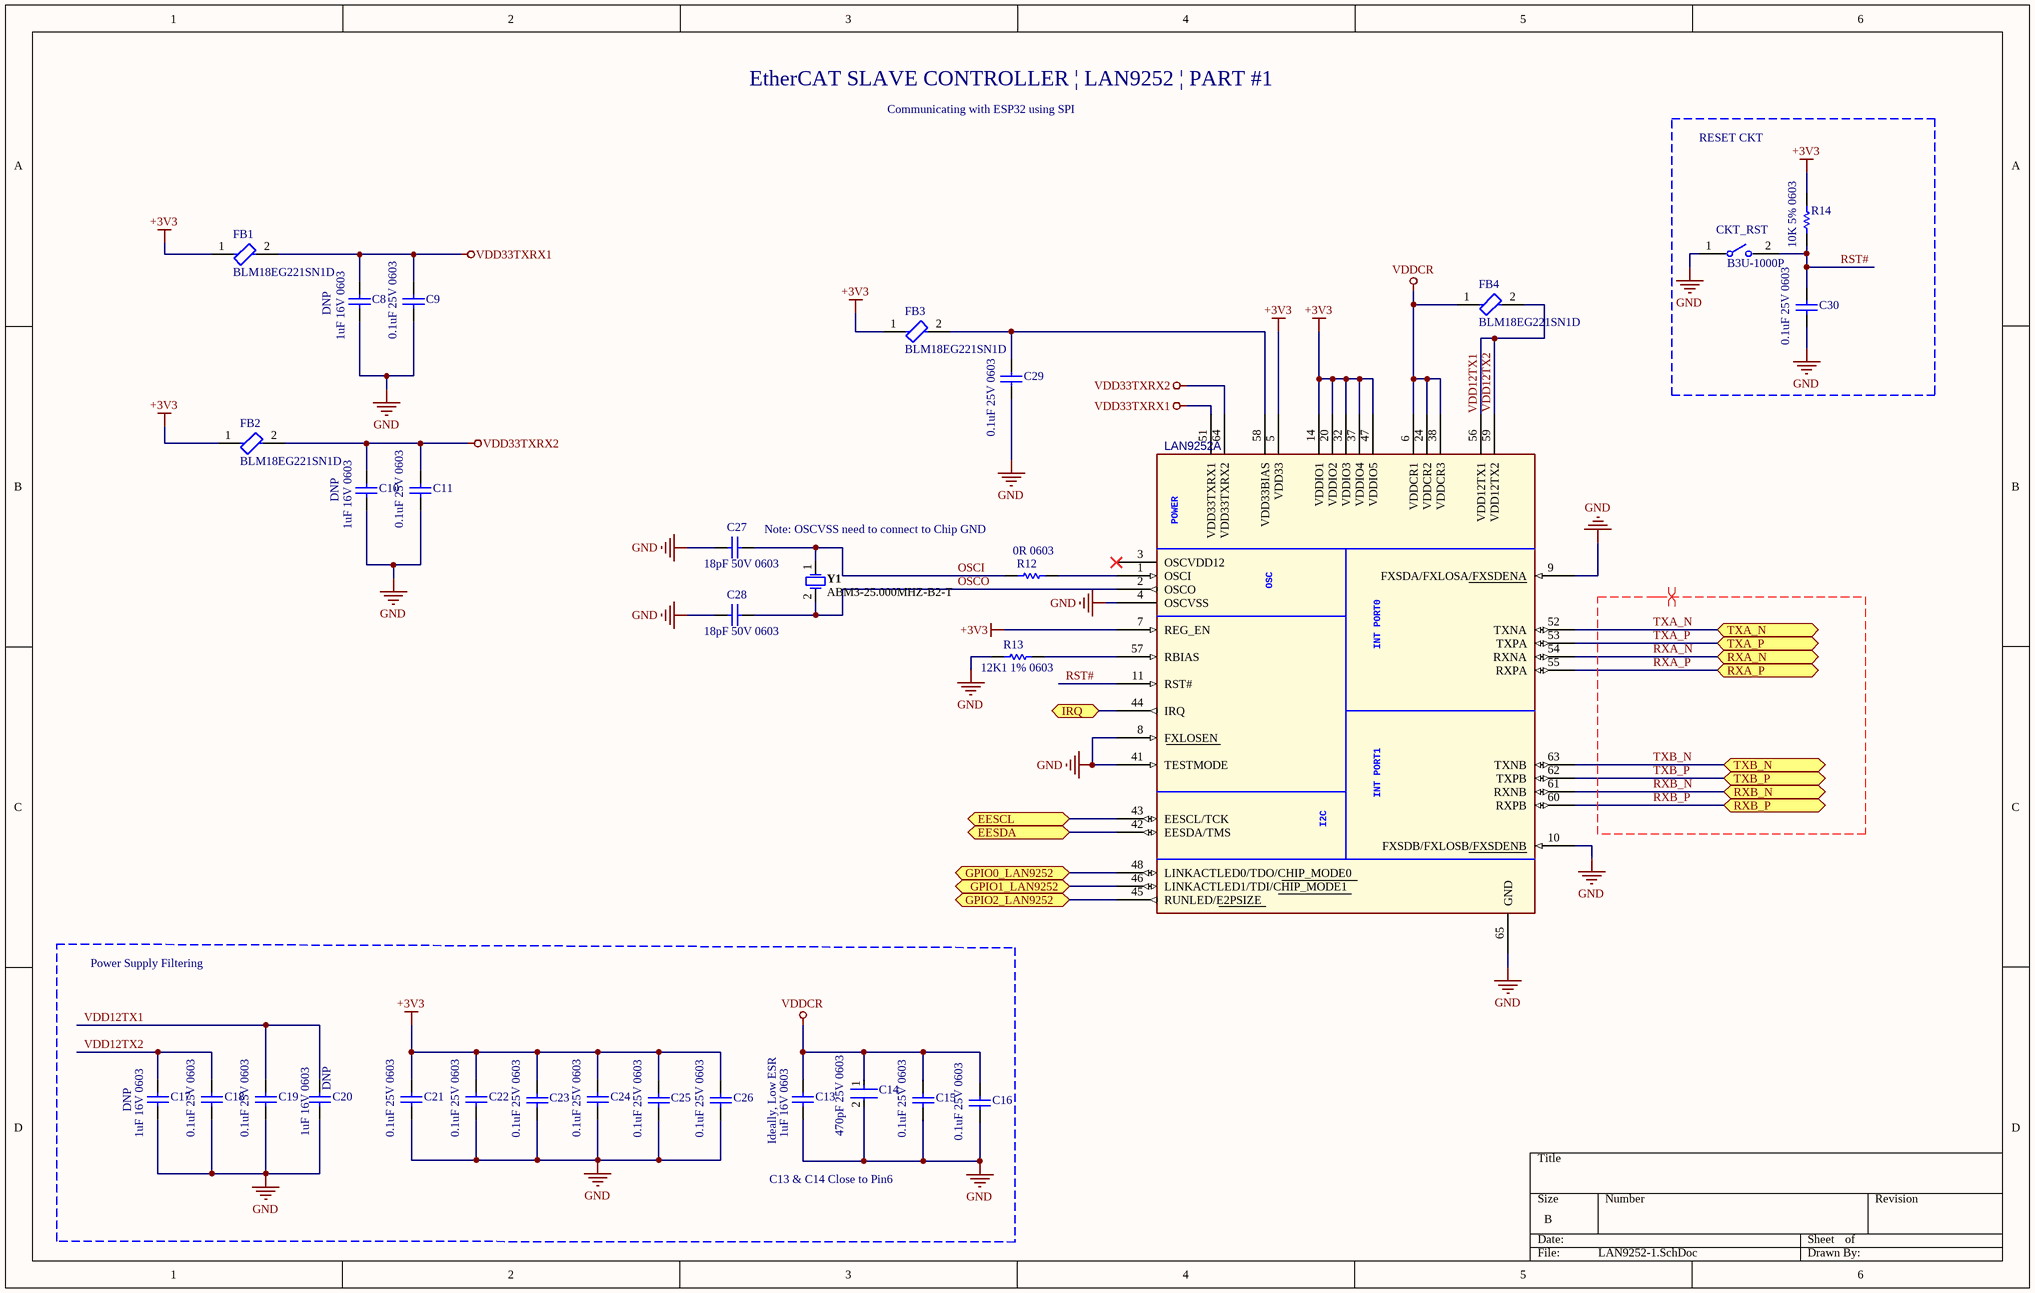
[diagram p3: LAN9252-1.SchDoc]

### Parts
C8  1uF 16V 0603  [CAPC1608X90X35LL15T15]
C9  0.1uF 25V 0603  [CAPC1608X90X35LL10T15]
C10  1uF 16V 0603  [CAPC1608X90X35LL15T15]
C11  0.1uF 25V 0603  [CAPC1608X90X35LL10T15]
C13  1uF 16V 0603  [CAPC1608X90X35LL15T15]
C14  470pF 25V 0603  [FP-C0603C-CF-MFG]
C15  0.1uF 25V 0603  [CAPC1608X90X35LL10T15]
C16  0.1uF 25V 0603  [CAPC1608X90X35LL10T15]
C17  1uF 16V 0603  [CAPC1608X90X35LL15T15]
C18  0.1uF 25V 0603  [CAPC1608X90X35LL10T15]
C19  0.1uF 25V 0603  [CAPC1608X90X35LL10T15]
C20  1uF 16V 0603  [CAPC1608X90X35LL15T15]
C21  0.1uF 25V 0603  [CAPC1608X90X35LL10T15]
C22  0.1uF 25V 0603  [CAPC1608X90X35LL10T15]
C23  0.1uF 25V 0603  [CAPC1608X90X35LL10T15]
C24  0.1uF 25V 0603  [CAPC1608X90X35LL10T15]
C25  0.1uF 25V 0603  [CAPC1608X90X35LL10T15]
C26  0.1uF 25V 0603  [CAPC1608X90X35LL10T15]
C27  18pF 50V 0603  [CAPC1608X90X40LL10T20]
C28  18pF 50V 0603  [CAPC1608X90X40LL10T20]
C29  0.1uF 25V 0603  [CAPC1608X90X35LL10T15]
C30  0.1uF 25V 0603  [CAPC1608X90X35LL10T15]
CKT_RST  B3U-1000P  [FP-B3U-1000P-MFG]
FB1  BLM18EG221SN1D  [FP-BLM18-0_15-t0_8-MFG]
FB2  BLM18EG221SN1D  [FP-BLM18-0_15-t0_8-MFG]
FB3  BLM18EG221SN1D  [FP-BLM18-0_15-t0_8-MFG]
FB4  BLM18EG221SN1D  [FP-BLM18-0_15-t0_8-MFG]
LAN9252  (no value)  [LAN9252_QFN]  (part A of 2)
R12  0R 0603  [RESC1608X55X25ML10T15]
R13  12K1 1% 0603  [RESC0603X28X15ML05T05]
R14  10K 5% 0603  [RESC1608X55X25ML10T15]
Y1  ABM3-25.000MHZ-B2-T  [ABRA-ABM3_V]

### Blocks framed on the sheet
RESET CKT: C30 CKT_RST R14

### Ports
EESCL (bidir), EESDA (bidir), GPIO0_LAN9252 (bidir), GPIO1_LAN9252 (bidir), GPIO2_LAN9252 (bidir), IRQ (bidir), RXA_N (bidir), RXA_P (bidir), RXB_N (bidir), RXB_P (bidir), TXA_N (bidir), TXA_P (bidir), TXB_N (bidir), TXB_P (bidir)

### Nets
+3V3: C21.2 C22.2 C23.2 C24.2 C25.2 C26.2 FB1.1 FB2.1 FB3.1 LAN9252.5(VDD33) LAN9252.7(REG_EN) LAN9252.14(VDDIO1) LAN9252.20(VDDIO2) LAN9252.32(VDDIO3) LAN9252.37(VDDIO4) LAN9252.47(VDDIO5) R14.2
GND: C8.1 C9.1 C10.1 C11.1 C13.1 C14.2 C15.1 C16.1 C17.1 C18.1 C19.1 C20.1 C21.1 C22.1 C23.1 C24.1 C25.1 C26.1 C27.1 C28.1 C29.1 C30.1 CKT_RST.1 LAN9252.4(OSCVSS) LAN9252.8(FXLOSEN) LAN9252.9(FXSDA/FXLOSA/FXSDENA) LAN9252.10(FXSDB/FXLOSB/FXSDENB) LAN9252.41(TESTMODE) LAN9252.65(GND) R13.1
VDD33TXRX1: C8.2 C9.2 FB1.2 LAN9252.51(VDD33TXRX1)
VDD33TXRX2: C10.2 C11.2 FB2.2 LAN9252.64(VDD33TXRX2)
VDDCR: C13.2 C14.1 C15.2 C16.2 FB4.1 LAN9252.6(VDDCR1) LAN9252.24(VDDCR2) LAN9252.38(VDDCR3)
IRQ: LAN9252.44(IRQ) ; port IRQ
OSCI: C27.2 R12.1 Y1.1
OSCO: C28.2 LAN9252.2(OSCO) Y1.2
RST#: C30.2 CKT_RST.2 LAN9252.11(RST#) R14.1
RXA_N: LAN9252.54(RXNA) ; port RXA_N
RXA_P: LAN9252.55(RXPA) ; port RXA_P
RXB_N: LAN9252.61(RXNB) ; port RXB_N
RXB_P: LAN9252.60(RXPB) ; port RXB_P
TXA_N: LAN9252.52(TXNA) ; port TXA_N
TXA_P: LAN9252.53(TXPA) ; port TXA_P
TXB_N: LAN9252.63(TXNB) ; port TXB_N
TXB_P: LAN9252.62(TXPB) ; port TXB_P
VDD12TX1: C17.2 C18.2 C19.2 C20.2 FB4.2 LAN9252.56(VDD12TX1) LAN9252.59(VDD12TX2)  [also labelled VDD12TX2]
NetC29_2: C29.2 FB3.2 LAN9252.58(VDD33BIAS)
NetEtherCAT_EEPROM_5: LAN9252.42(EESDA/TMS) ; port EESDA
NetEtherCAT_EEPROM_6: LAN9252.43(EESCL/TCK) ; port EESCL
NetLAN9252_1: LAN9252.1(OSCI) R12.2
NetLAN9252_45: LAN9252.45(RUNLED/E2PSIZE) ; port GPIO2_LAN9252
NetLAN9252_46: LAN9252.46(LINKACTLED1/TDI/CHIP_MODE1) ; port GPIO1_LAN9252
NetLAN9252_48: LAN9252.48(LINKACTLED0/TDO/CHIP_MODE0) ; port GPIO0_LAN9252
NetLAN9252_57: LAN9252.57(RBIAS) R13.2

Not connected (* = marked no-connect by the designer): LAN9252 3(OSCVDD12)*

### Layout directives
differential pair; differential pair class ETHERNET; rule Differential Pairs Routing [Pref Gap = 0.254mm    Min Gap  = 0.254mm    Max Gap  = 0.254mmPref Width = 0.381mm    Min Width  = 0.127mm    Max Width  = 0.381mm]: RXA_N, RXA_P, RXB_N, RXB_P, TXA_N, TXA_P, TXB_N, TXB_P

### Notes on the sheet
- EtherCAT SLAVE CONTROLLER | LAN9252 | PART #1
- Communicating with ESP32 using SPI
- (near C8) DNP
- (near C10) DNP
- Note: OSCVSS need to connect to Chip GND
- Power Supply Filtering
- (near C17) DNP
- (near C20) DNP
- (near C13) Ideally, Low ESR
- C13 & C14 Close to Pin6
- (in symbol LAN9252_QFN64, part A) POWER; OSC; INT PORT0; INT PORT1; I2C

### Library data of the parts
C8 C10 C13 C17 C20 = CMP-2006-02298-2: Manufacturer: Kemet; Part Number: C0603C105K4RACTU
C9 C11 C15 C16 C18 C19 C21-C26 C29 C30 = CMP-2006-02868-1: as C2 on sheet USB-ESP32
C14 = CMP-1035-01671-3: CAP CER 470PF 25V 10% X7R 0603; Manufacturer: KEMET; Manufacturer Part Number: C0603C471K3RACTU; Tolerance: 0.1; Automotive Grade: Grade 1; Material: Ceramic; Temperature Coefficient: 30ppm/°C; Category: Cap; Device Class L2: Capacitors; ComponentLink2URL: https://api.kemet.com/component-edge/download/datasheet/C0603C100J5GACAUTO.pdf; Voltage Rating: 25 V; RoHS: TRUE; Value: 470 pF; Automotive: Yes; Capacitance: 470 pF; Temperature Characteristic: X7R; Height: 0.87mm; Lead Free: Yes; Temperature: -55°C to +125°C; Temperature Range High: +125°C; Package: C0603C-CF; Digikey Description: CAP CER 470PF 25V 10% X7R 0603; Mouser Description: Multilayer Ceramic Capacitors MLCC - SMD/SMT 25volts 470pF X7R 10%; Device Class L1: Passive Components; ComponentLink2Description: Datasheet; Device Class L3: Ceramic Capacitors; Temperature Range Low: -55°C; Octopart: https://octopart.com/c0603c471k3ractu-kemet-9143746
C27 C28 = CMP-1659-00030-1: Chip Capacitor, 18 pF, +/- 5%, 50 V, -55 to 125 degC, 0603 (1608 Metric), RoHS, Tape and Reel; Case\Package: 0603; Power Rating: 100 mW; Resistance: 68.1 Ohm; Tolerance: 1%; Case Code (Metric): 1608; Max Operating Temperature: 155 degC; RoHSCompliant: true; Case Code (Imperial): 0603; Voltage Rating: 50 V; ComponentLink2Description: Datasheet; Package Quantity: 200; PackageReference: 0603; ComponentLink2URL: http://www.yageo.com/NewPortal/yageodocoutput?fileName=/pdf/MLCC/UPY-GP_NP0_16V-to-50V_14.pdf; Length: 1.6 mm; DatasheetVersion: Rev. 14, 07/2016; Min Operating Temperature: -55 degC; ComponentLink1URL: http://www.yageo.com/; Width: 0.8 mm; ComponentLink1Description: Manufacturer URL; Height: 0.45 mm; Radiation Hardening: No; PackageDescription: 2-Pin Surface Mount Device, Body 1.6 x 0.8 mm; Packaging: Tape and Reel
CKT_RST = CMP-2100-03586-2: as ESP32_BOOT on sheet ESP32; Height: 1.2mm; Width: 3mm; Weight: 0.000776oz; Contact Material: Silver; Max Voltage Rating (DC): 12V; Insulation Resistance: 100MR; Lead Free: Lead Free; Current Rating: 50mA; Termination: SMD/SMT; Length: 4mm; Voltage Rating (DC): 12V; Contact Current Rating: 50mA; Orientation: Straight; Depth: 2.5mm; Max Operating Temperature: 70°C; Packaging: Tape and Reel; Min Operating Temperature: -25°C; Package Quantity: 1; Mount: Surface Mount; Electrical Life: 200000Cycles
FB1-FB4 = CMP-0686-00360-3: Chip Ferrite Bead, 0603, 220Ω @ 100MHz, 0.05Ω, 25%, 2A; Impedance: 220R; Number of Lines: 1; Material: Steel; Resistance: 50mR; Core Material: Ferrite; Test Frequency: 100MHz; Contact Plating: Tin; Case Code (Imperial): 0603; DC Current: 2A; Lead Free: Lead Free; Frequency: 100MHz; Max Current Rating: 2A; Depth: 0.8mm; Width: 0.8mm; Number of Pins: 2; Min Operating Temperature: -55°C; Package Quantity: 1; Tolerance: 25%; Max Operating Temperature: 125°C; Height: 0.8mm; Military Standard: Not; Termination: SMD/SMT; REACH SVHC: No SVHC; Max DC Current: 2A; Radiation Hardening: No; Case Code (Metric): 1608; Current Rating: 2A; Number of Circuits: 1; Length: 1.6mm; Case/Package: 0603; Packaging: Tape and Reel; DC Resistance (DCR): 50mR
LAN9252 = LAN9252_QFN64: IC, 2/3-Port EtherCAT® Slave Controller, QFN64; Manufacturer Part Number 1: LAN9252x/ML; Manufacturer 1: Microchip; Populated: Yes; Owner: Manikandan; Supplier Part Number 1: LAN9252I/ML-ND; Supplier 1: Digikey; Description_: IC, 2/3-Port EtherCAT® Slave Controller, QFN64; RoHS: Yes; Package: QFN64-9X9x1; Document Link: http://ww1.microchip.com/downloads/en/DeviceDoc/00001909A.pdf; Status: New
R12 = CMP-2100-03667-1: as R5 on sheet USB-ESP32; Width: 0.8mm; Max Operating Temperature: 155degC; Tolerance: 5%; Package Reference: 0603; Height: 0.45mm; Depth: 0.8mm; Package Description: 2-Pin Surface Mount Device, Body 1.6 x 0.8 mm; Termination: SMD/SMT; Package Quantity: 5000; Case/Package: 0603; Case Code (Imperial): 0603; Radiation Hardening: No; Number of Pins: 2; Length: 1.6mm; Lead Free: LeadFree; Voltage Rating (DC): 50V; Military Standard: Not; Datasheet URL: http://www.yageo.com/NewPortal/yageodocoutput?fileName=/pdf/R-Chip/PYu-RC_Group_51_RoHS_L_5.pdf; Manufacturer URL: http://www.yageo.com/; Packaging: TapeandReel; Case Code (Metric): 1608; Min Operating Temperature: -55degC; Composition: ThickFilm; RoHSCompliant: true; Contact Plating: Tin; Datasheet Version: Rev. 5, 10/2016; REACH SVHC: NoSVHC
R13 = CMP-2004-00071-1: Part Number: CRCW020112K1FNED; Manufacturer: Vishay Dale
R14 = CMP-2100-03664-1: as R1 on sheet USB-ESP32; Composition: ThickFilm; RoHSCompliant: true; Height: 0.45mm; Lead Free: LeadFree; Case Code (Metric): 1608; Case/Package: 0603; Datasheet Version: Rev. 5, 10/2016; Package Reference: 0603; Depth: 0.8mm; Package Description: 2-Pin Surface Mount Device, Body 1.6 x 0.8 mm; Case Code (Imperial): 0603; Packaging: TapeandReel; Termination: SMD/SMT; Lead Pitch: 0.3mm; Width: 0.8mm; Number of Pins: 2; Length: 1.6mm; REACH SVHC: NoSVHC; Military Standard: Not; Max Operating Temperature: 155degC; Min Operating Temperature: -55degC; Manufacturer URL: http://www.yageo.com/; Datasheet URL: http://www.yageo.com/NewPortal/yageodocoutput?fileName=/pdf/R-Chip/PYu-RC_Group_51_RoHS_L_5.pdf; Weight: 7.1E-05oz; Tolerance: 1%
Y1 = CMP-2000-05729-1: Miniature Ceramic Crystal, 25 MHz, +/- 20 ppm, -20 to 70 degC, 2-Pin SMD, RoHS, Tape and Reel; Manufacturer: ABRACON; Case Height: 1.3mm; Tolerance: 20PPM; Load Capacitance: 18pF; Frequency: 25MHz; ESR: 30Ohms; Frequency Stability: 50PPM; Case Width: 3.2mm; Case Length: 5mm; Packaging: Reel; Package Description: 2-Pin Surface Mount Device, Body 5 x 3.2 mm; Manufacturer URL: http://www.abracon.com/; Mounting Technology: SurfaceMount; RoHS: Details; Operating Temperature Range: -20Cto+70C; Datasheet URL: http://www.abracon.com/Resonators/abm3.pdf; Type: MiniatureCeramicCrystal; Series: ABM3; Product Category: Crystals; Factory Pack Quantity: 1000; Mounting Style: SMD/SMT; Brand: ABRACON; Datasheet Version: 09/2013; Dimensions: 3.2mmWx5mmLx1.3mmH; Termination Style: SMD/SMT; Package Reference: ABM3; Package / Case: 5mmx3.2mm

## Sheet LAN9252-2.SchDoc
size B
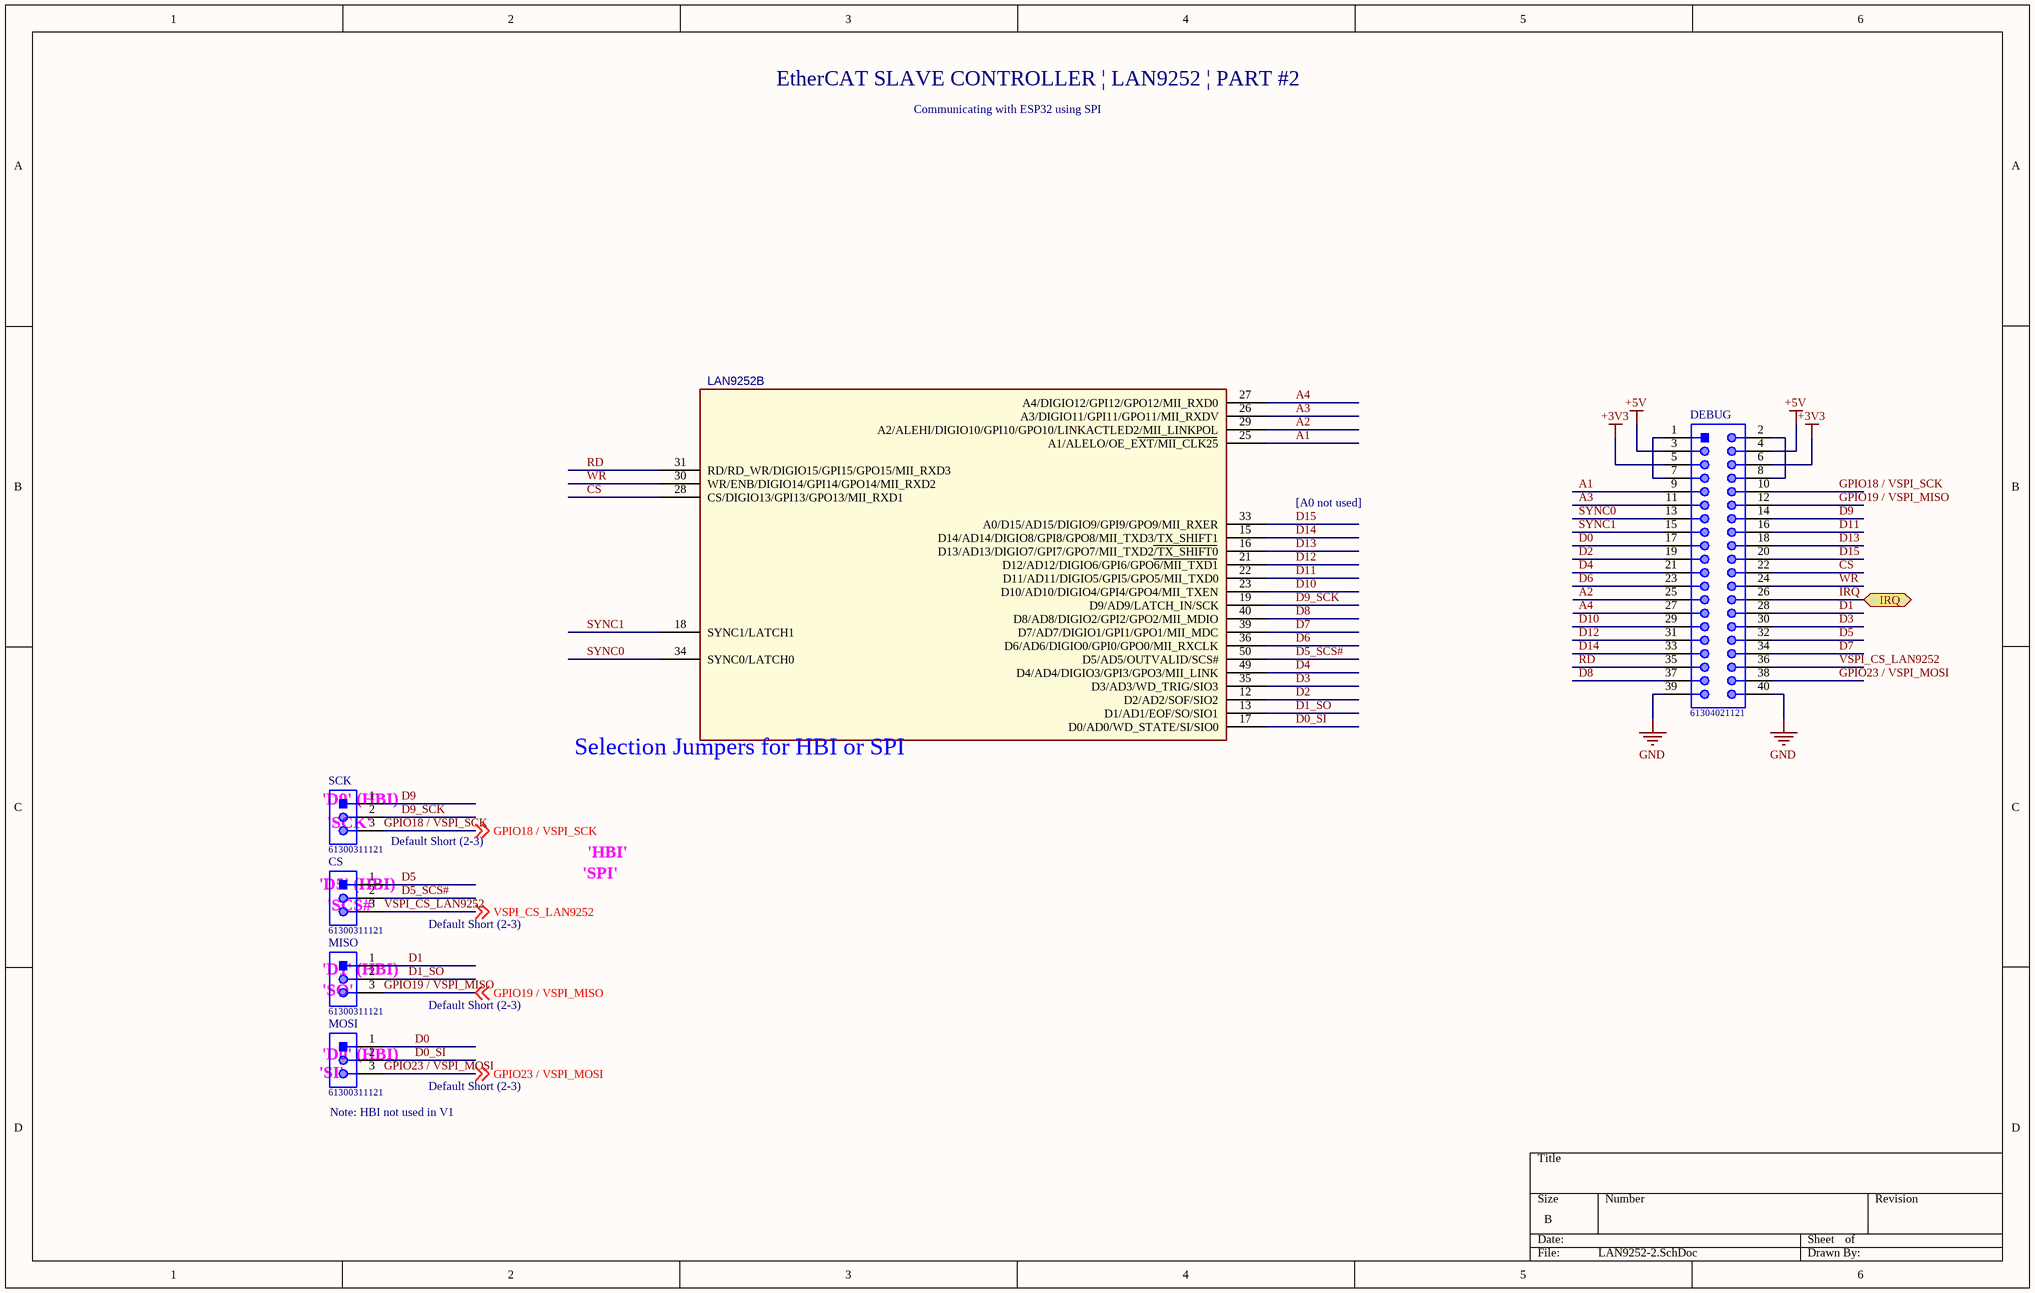
[diagram p4: LAN9252-2.SchDoc]

### Parts
CS  61300311121  [61300311121]
DEBUG  61304021121  [61304021121]
LAN9252  (no value)  [LAN9252_QFN]  (part B of 2)
MISO  61300311121  [61300311121]
MOSI  61300311121  [61300311121]
SCK  61300311121  [61300311121]

### Ports
IRQ (bidir)

### Nets
+3V3: DEBUG.5 DEBUG.6
+5V: DEBUG.3 DEBUG.4
GND: DEBUG.39 DEBUG.40
A1: DEBUG.9 LAN9252.25(A1/ALELO/OE_EXT/MII_CLK25)
A2: DEBUG.25 LAN9252.29(A2/ALEHI/DIGIO10/GPI10/GPO10/LINKACTLED2/MII_LINKPOL)
A3: DEBUG.11 LAN9252.26(A3/DIGIO11/GPI11/GPO11/MII_RXDV)
A4: DEBUG.27 LAN9252.27(A4/DIGIO12/GPI12/GPO12/MII_RXD0)
CS: DEBUG.22 LAN9252.28(CS/DIGIO13/GPI13/GPO13/MII_RXD1)
D0: DEBUG.17 MOSI.1
D0_SI: LAN9252.17(D0/AD0/WD_STATE/SI/SIO0) MOSI.2
D1: DEBUG.28 MISO.1
D1_SO: LAN9252.13(D1/AD1/EOF/SO/SIO1) MISO.2
D2: DEBUG.19 LAN9252.12(D2/AD2/SOF/SIO2)
D3: DEBUG.30 LAN9252.35(D3/AD3/WD_TRIG/SIO3)
D4: DEBUG.21 LAN9252.49(D4/AD4/DIGIO3/GPI3/GPO3/MII_LINK)
D5: CS.1 DEBUG.32
D5_SCS#: CS.2 LAN9252.50(D5/AD5/OUTVALID/SCS#)
D6: DEBUG.23 LAN9252.36(D6/AD6/DIGIO0/GPI0/GPO0/MII_RXCLK)
D7: DEBUG.34 LAN9252.39(D7/AD7/DIGIO1/GPI1/GPO1/MII_MDC)
D8: DEBUG.37 LAN9252.40(D8/AD8/DIGIO2/GPI2/GPO2/MII_MDIO)
D9: DEBUG.14 SCK.1
D9_SCK: LAN9252.19(D9/AD9/LATCH_IN/SCK) SCK.2
D10: DEBUG.29 LAN9252.23(D10/AD10/DIGIO4/GPI4/GPO4/MII_TXEN)
D11: DEBUG.16 LAN9252.22(D11/AD11/DIGIO5/GPI5/GPO5/MII_TXD0)
D12: DEBUG.31 LAN9252.21(D12/AD12/DIGIO6/GPI6/GPO6/MII_TXD1)
D13: DEBUG.18 LAN9252.16(D13/AD13/DIGIO7/GPI7/GPO7/MII_TXD2/TX_SHIFT0)
D14: DEBUG.33 LAN9252.15(D14/AD14/DIGIO8/GPI8/GPO8/MII_TXD3/TX_SHIFT1)
D15: DEBUG.20 LAN9252.33(A0/D15/AD15/DIGIO9/GPI9/GPO9/MII_RXER)
GPIO18 / VSPI_SCK: DEBUG.10 SCK.3 ; off-sheet GPIO18 / VSPI_SCK
GPIO19 / VSPI_MISO: DEBUG.12 MISO.3 ; off-sheet GPIO19 / VSPI_MISO
GPIO23 / VSPI_MOSI: DEBUG.38 MOSI.3 ; off-sheet GPIO23 / VSPI_MOSI
IRQ: DEBUG.26 ; port IRQ
RD: DEBUG.35 LAN9252.31(RD/RD_WR/DIGIO15/GPI15/GPO15/MII_RXD3)
SYNC0: DEBUG.13 LAN9252.34(SYNC0/LATCH0)
SYNC1: DEBUG.15 LAN9252.18(SYNC1/LATCH1)
VSPI_CS_LAN9252: CS.3 DEBUG.36 ; off-sheet VSPI_CS_LAN9252
WR: DEBUG.24 LAN9252.30(WR/ENB/DIGIO14/GPI14/GPO14/MII_RXD2)
NetDEBUG_1: DEBUG.1 DEBUG.7
NetDEBUG_2: DEBUG.2 DEBUG.8

### Notes on the sheet
- EtherCAT SLAVE CONTROLLER | LAN9252 | PART #2
- Communicating with ESP32 using SPI
- [A0 not used]
- (near SCK) Selection Jumpers for HBI or SPI
- (near SCK) 'D9' (HBI)
- (near SCK) 'SCK'
- 'D5' (HBI)
- (near CS) 'SCS#'
- Default Short (2-3)
- 'SPI'
- 'HBI'
- (near MISO) 'D1' (HBI)
- (near MISO) 'SO'
- (near MOSI) 'SI'
- (near MOSI) 'D0' (HBI)
- (near MOSI) Note: HBI not used in V1

### Library data of the parts
CS MISO MOSI SCK = CMP-1502-01062-1: THT Vertical Pin Header WR-PHD, Pitch 2.54 mm, Single Row, 3 pins; Manufacturer: Wurth Elektronik; Withstanding Voltage: 500VAC; Working Voltage: 250VAC; Rated Current: 3A; Pitch: 2.54mm; Pin Number: 3; Gender: Male; Contact Resistance: 20mOhm; Package Reference: 61300311121; Manufacturer URL: http://www.we-online.de; Datasheet URL: https://katalog.we-online.de/em/datasheet/6130xx11121.pdf; Operating Temperature: -40to105degC; Part Number: 61300311121; Orientation: Vertical; Packaging: Bag; Row Number: Single; Mounting Technology: THT; Publisher: WurthElektronik
DEBUG = CMP-1502-01135-1: THT Vertical Pin Header WR-PHD, Pitch 2.54 mm, Dual Row, 40 pins; Manufacturer: Wurth Elektronik; Contact Resistance: 20mOhm; Pitch: 2.54mm; Pin Number: 40; Withstanding Voltage: 500VAC; Gender: Male; Rated Current: 3A; Working Voltage: 250VAC; Operating Temperature: -40to105degC; Manufacturer URL: http://www.we-online.de; Orientation: Vertical; Datasheet URL: https://katalog.we-online.de/em/datasheet/6130xx21121.pdf; Package Reference: 61304021121; Row Number: Dual; Part Number: 61304021121; Packaging: Bag; Mounting Technology: THT; Publisher: WurthElektronik
LAN9252 = LAN9252_QFN64: as LAN9252 on sheet LAN9252-1; Supplier Part Number 1: LAN9252I/ML-ND; Supplier 1: Digikey; Description_: IC, 2/3-Port EtherCAT® Slave Controller, QFN64; RoHS: Yes; Package: QFN64-9X9x1; Document Link: http://ww1.microchip.com/downloads/en/DeviceDoc/00001909A.pdf; Status: New